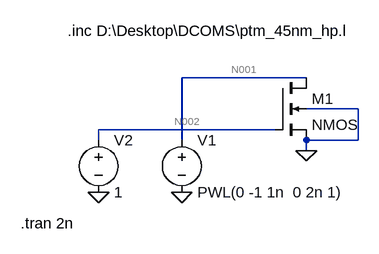
[diagram p0: schematic Draft1.asc]
Draft1.asc, the LTspice schematic file:
Version 4
SHEET 1 880 680
WIRE 272 112 80 112
WIRE 352 160 272 160
WIRE 224 192 -48 192
WIRE -48 208 -48 192
WIRE 80 208 80 112
WIRE 352 208 352 160
WIRE 352 208 272 208
WIRE 272 224 272 208
FLAG 272 224 0
FLAG -48 288 0
FLAG 80 288 0
SYMBOL nmos4 224 112 R0
SYMATTR InstName M1
SYMATTR Value2 l=1u w=360nm
SYMBOL voltage 80 192 R0
SYMATTR InstName V1
SYMATTR Value PWL(0 -1 1n  0 2n 1)
SYMBOL voltage -48 192 R0
WINDOW 123 0 0 Left 0
WINDOW 39 0 0 Left 0
SYMATTR InstName V2
SYMATTR Value 1
TEXT -96 40 Left 2 !.inc D:\\Desktop\\DCOMS\\ptm_45nm_hp.l
TEXT -168 336 Left 2 !.tran 2n

The netlist it stands for:
* Draft1.asc
M1 N001 N002 0 0 NMOS l=1u w=360nm
V1 N001 0 PWL(0 -1 1n  0 2n 1)
V2 N002 0 1
.model NMOS NMOS
.model PMOS PMOS
.lib standard.mos
.inc D:\Desktop\DCOMS\ptm_45nm_hp.l
.tran 2n
.backanno
.end

* Results of the author's LTspice run, read from the files saved beside the schematic
* Operating Point, zero values left out:
*   V(n001) = -1 V
*   V(n002) = 1 V
*   Id(M1) = -28.33 mA
*   Ig(M1) = 30.03 µA
*   Ib(M1) = 28.21 mA
*   Is(M1) = 93.23 µA
*   I(V1) = 28.33 mA
*   I(V2) = -30.03 µA
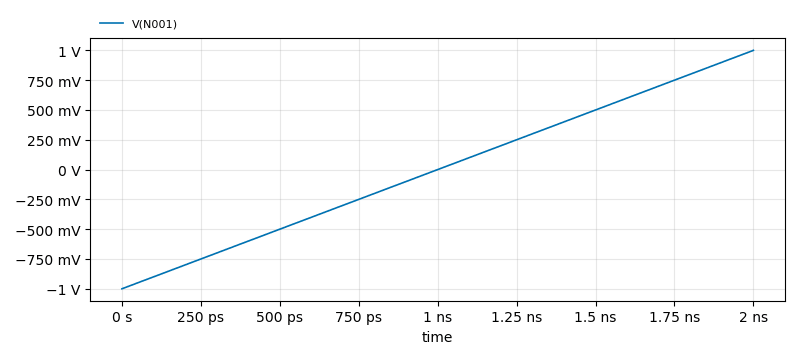
[diagram p1: Transient Analysis of Draft1.asc, plotted from the saved traces]
* Transient Analysis, 1 run:
*   V(N001): min -1 V, max 1 V, average 0 V, rms 578.1 mV, last 1 V